# Altium schematic sheet DISCHARGE23-ESF.SchDoc
size A4
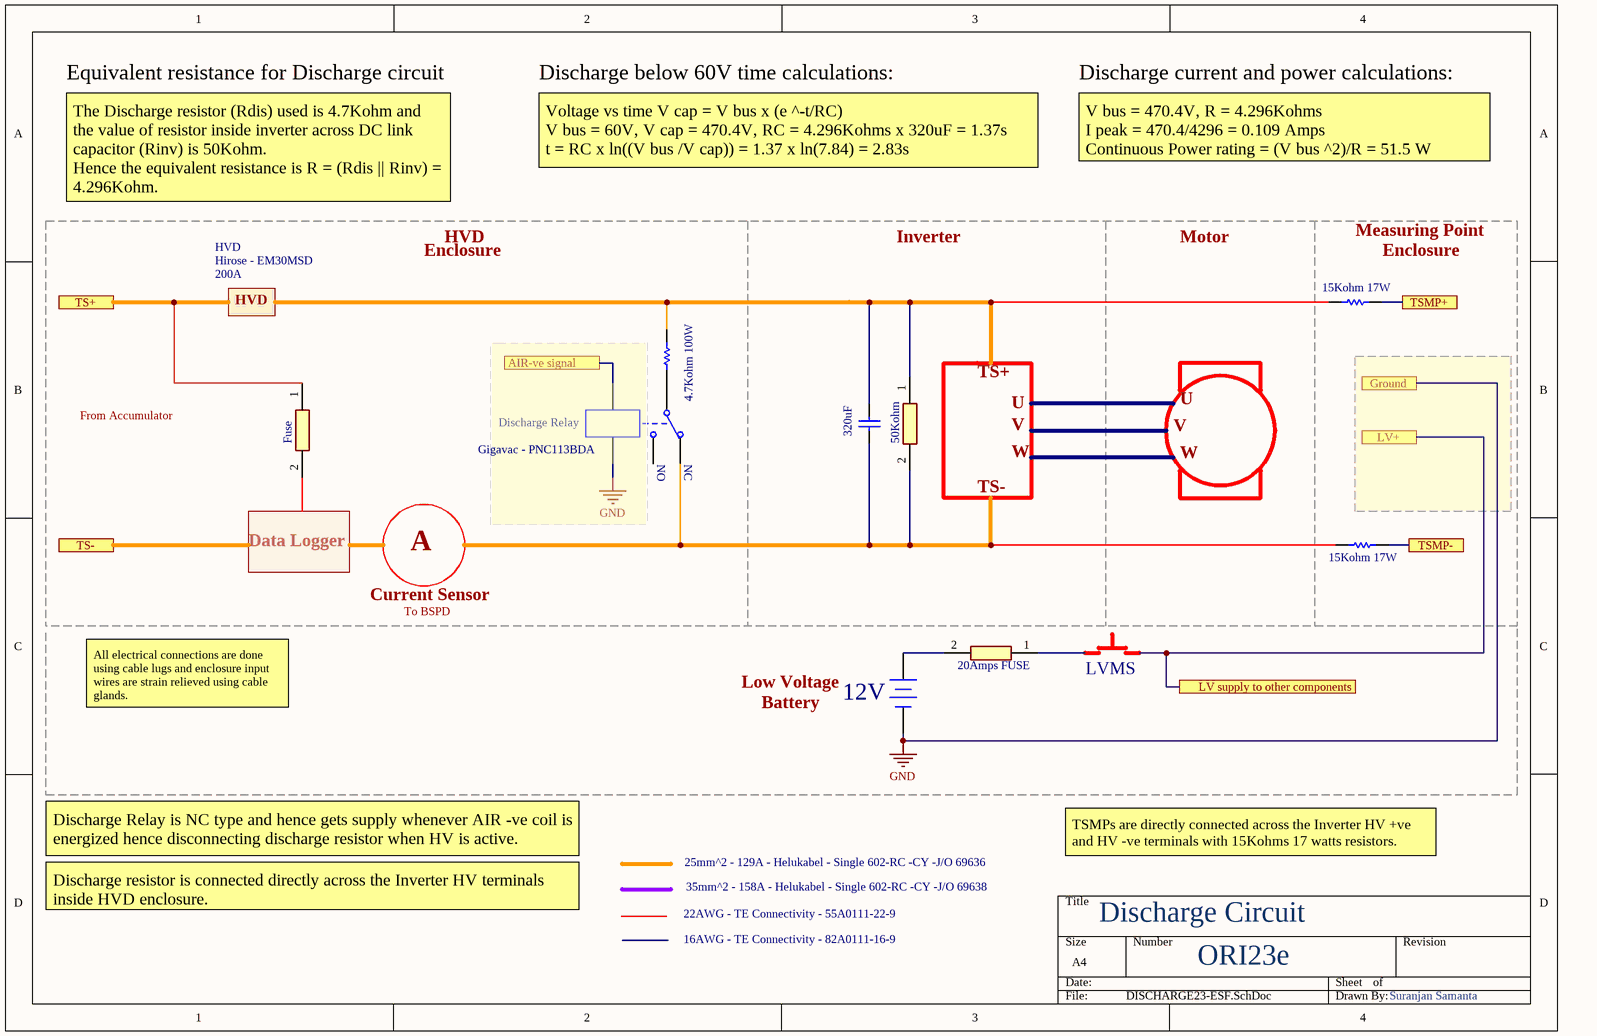
[diagram p0: DISCHARGE23-ESF.SchDoc]

## Parts
(Parts that share a designator on the sheet are numbered #1, #2 ... from top to bottom, then left to right.)
12V  tter  [BAT-2]  (value not drawn)
?  Discharge Relay  [MODULE5B]
C?  value 320uF  [RAD-0.3]  (hidden comment: Cap)
R?#1  15Kohm 17W  [AXIAL-0.3]
R?#2  4.7Kohm 100W  [AXIAL-0.3]
R?#3  50Kohm  [RESC0603X28N]
R?#4  Fuse  [RESC0603X28N]
R?#5  15Kohm 17W  [AXIAL-0.3]
R?#6  20Amps FUSE  [RESC0603X28N]

## Ports
AIR-ve signal, Ground, LV supply to other components, LV+, TS+, TS-, TSMP+, TSMP-

## Nets
GND: 12V.2(-) ?.5 ; port Ground
AIR-ve signal: ?.4 ; port AIR-ve signal
LV supply to other components: port LV+, port LV supply to other components
TS+: R?#4.1 ; port TS+
TSMP+: R?#1.2 ; port TSMP+
TSMP-: R?#5.2 ; port TSMP-
Net12V_1: 12V.1(+) R?#6.2
Net?_1: ?.1 R?#2.1
Net?_2: ?.2 C?.1 R?#3.2 R?#5.1
NetC?_2: C?.2 R?#1.1 R?#2.2 R?#3.1

Not connected (* = marked no-connect by the designer): ? 3; R?#4 2; R?#6 1

## Notes on the sheet
- Equivalent resistance for Discharge circuit
- Discharge below 60V time calculations:
- Discharge current and power calculations:
- Voltage vs time V cap = V bus x (e ^-t/RC)
  V bus = 60V, V cap = 470.4V, RC = 4.296Kohms x 320uF = 1.37s
  t = RC x ln((V bus /V cap)) = 1.37 x ln(7.84) = 2.83s
- V bus = 470.4V, R = 4.296Kohms
  I peak = 470.4/4296 = 0.109 Amps
  Continuous Power rating = (V bus ^2)/R = 51.5 W
- The Discharge resistor (Rdis) used is 4.7Kohm and the value of resistor inside inverter across DC link capacitor (Rinv) is 50Kohm.
  Hence the equivalent resistance is R = (Rdis || Rinv) = 4.296Kohm.
- HVD
- Inverter
- Motor
- Measuring Point
- Hirose - EM30MSD
- 200A
- Enclosure
- (near R?#1) Enclosure
- TS+
- From Accumulator
- U
- V
- Gigavac - PNC113BDA
- NO
- NC
- TS-
- W
- Data Logger
- A
- Current Sensor
- To BSPD
- All electrical connections are done using cable lugs and enclosure input wires are strain relieved using cable glands.
- Low Voltage
- Battery
- LVMS
- Discharge Relay is NC type and hence gets supply whenever AIR -ve coil is energized hence disconnecting discharge resistor when HV is active.
- TSMPs are directly connected across the Inverter HV +ve and HV -ve terminals with 15Kohms 17 watts resistors.
- Discharge resistor is connected directly across the Inverter HV terminals inside HVD enclosure.
- 22AWG - TE Connectivity - 55A0111-22-9
- 25mm^2 - 129A - Helukabel - Single 602-RC -CY -J/O 69636
- 35mm^2 - 158A - Helukabel - Single 602-RC -CY -J/O 69638
- Discharge Circuit
- 16AWG - TE Connectivity - 82A0111-16-9
- ORI23e
- Suranjan Samanta

## Library data of the parts
12V = Battery: Multicell Battery; Published: 24-Mar-1999; LatestRevisionDate: 17-Jul-2002; LatestRevisionNote: Re-released for DXP Platform.; PackageReference: BAT-2; Publisher: Altium Limited; PackageDescription: Battery; 2 Leads
? = Relay-SPDT: Single-Pole Dual-Throw Relay; Published: 24-Mar-1999; LatestRevisionDate: 17-Jul-2002; LatestRevisionNote: Re-released for DXP Platform.; PackageReference: MODULE5B; Publisher: Altium Limited
C? = Cap: Capacitor; Published: 8-Jun-2000; LatestRevisionDate: 17-Jul-2002; LatestRevisionNote: Re-released for DXP Platform.; PackageReference: RAD-0.3; Publisher: Altium Limited; PackageDescription: Radial Cap, Thru-Hole; 2 Leads; 0.3 in Pin Spacing
R?#1 R?#2 = Res1: Resistor; Value: 1K; Published: 8-Jun-2000; LatestRevisionDate: 17-Jul-2002; LatestRevisionNote: Re-released for DXP Platform.; PackageReference: AXIAL-0.3; Publisher: Altium Limited; PackageDescription: Axial Device, Thru-Hole; 2 Leads; 0.3 in Pin Spacing
R?#3 R?#4 R?#6 = CPF0201D100RE1: Resistor; Manufacturer_Name: TE Connectivity; Datasheet Link: http://www.te.com/commerce/DocumentDelivery/DDEController?Action=showdoc&DocId=Data+Sheet%7F1773200-1%7FA%7Fpdf%7FEnglish%7FENG_DS_1773200-1_A.pdf%7F4-2176215-6; Height: 0.28mm; Manufacturer_Part_Number: CPF0201D100RE1; Mouser Part Number: 279-CPF0201D100RE1; Mouser Price/Stock: https://www.mouser.com/Search/Refine.aspx?Keyword=279-CPF0201D100RE1; RS Part Number: 7549192; RS Price/Stock: http://uk.rs-online.com/web/p/products/7549192
R?#5 = Res1: Resistor; Published: 8-Jun-2000; LatestRevisionDate: 17-Jul-2002; LatestRevisionNote: Re-released for DXP Platform.; PackageReference: AXIAL-0.3; Publisher: Altium Limited; PackageDescription: Axial Device, Thru-Hole; 2 Leads; 0.3 in Pin Spacing